# Altium schematic sheet Sheet1.SchDoc
size A3
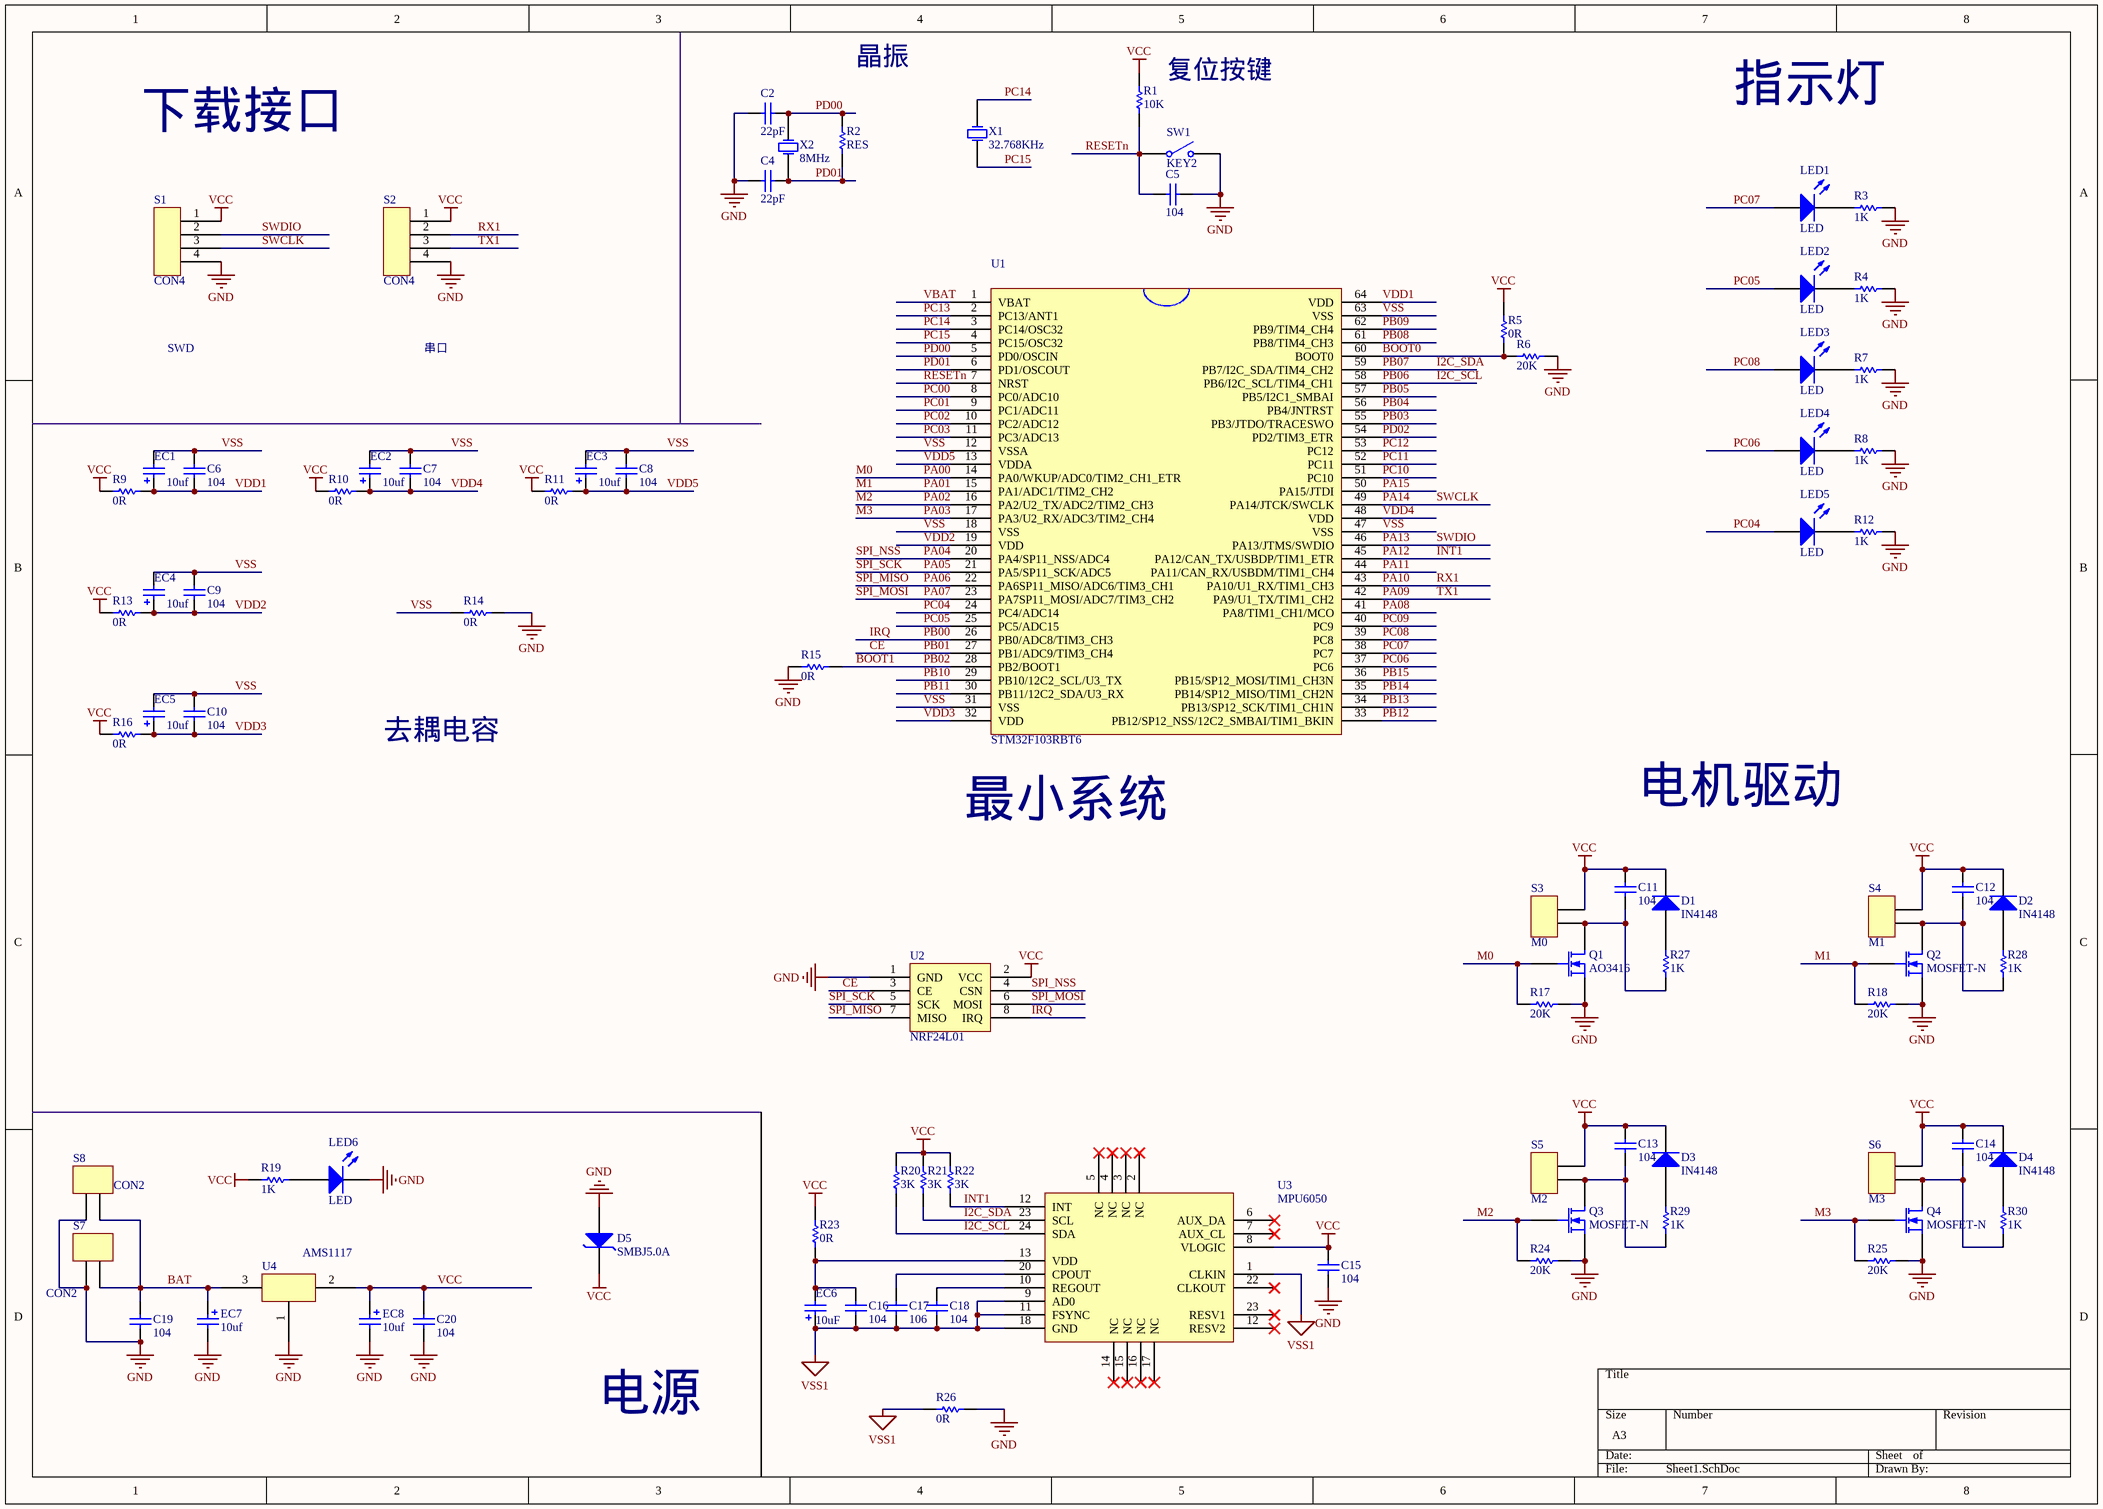
[diagram p0: Sheet1.SchDoc]

## Parts
C2  22pF  [0805]
C4  22pF  [0805]
C5  104  [0603]
C6  104  [0603]
C7  104  [0603]
C8  104  [0603]
C9  104  [0603]
C10  104  [0603]
C11  104  [0603]
C12  104  [0603]
C13  104  [0603]
C14  104  [0603]
C15  104  [0603]
C16  104  [0603]
C17  106  [0805]
C18  104  [0603]
C19  104  [0603]
C20  104  [0603]
D1  IN4148  [1206]
D2  IN4148  [1206]
D3  IN4148  [1206]
D4  IN4148  [1206]
D5  SMBJ5.0A  [DIOM4436X23N]
EC1  10uf  [1206]
EC2  10uf  [1206]
EC3  10uf  [1206]
EC4  10uf  [1206]
EC5  10uf  [1206]
EC6  10uF  [1206]
EC7  10uf  [1206]
EC8  10uf  [1206]
LED1  LED  [0805]
LED2  LED  [0805]
LED3  LED  [0805]
LED4  LED  [0805]
LED5  LED  [0805]
LED6  LED  [0805]
Q1  AO3416  [SOT-23_N]
Q2  MOSFET-N  [SOT-23_N]
Q3  MOSFET-N  [SOT-23_N]
Q4  MOSFET-N  [SOT-23_N]
R1  10K  [0603]
R2  RES  [0805]
R3  1K  [0603]
R4  1K  [0603]
R5  0R  [0603]
R6  20K  [0603]
R7  1K  [0603]
R8  1K  [0603]
R9  0R  [0603]
R10  0R  [0603]
R11  0R  [0603]
R12  1K  [0603]
R13  0R  [0603]
R14  0R  [0603]
R15  0R  [0603]
R16  0R  [0603]
R17  20K  [0603]
R18  20K  [0603]
R19  1K  [0603]
R20  3K  [0603]
R21  3K  [0603]
R22  3K  [0603]
R23  0R  [0603]
R24  20K  [0603]
R25  20K  [0603]
R26  0R  [0603]
R27  1K  [0603]
R28  1K  [0603]
R29  1K  [0603]
R30  1K  [0603]
S1  CON4  [SIP4]
S2  CON4  [SIP4]
S3  M0  [0805]
S4  M1  [0805]
S5  M2  [0805]
S6  M3  [0805]
S7  CON2  [1206]
S8  CON2  [SIP2]
SW1  KEY2  [SSOP2N]
U1  STM32F103RBT6  [TSQFP50P1200X1200X160-64N]
U2  NRF24L01  [CN8]
U3  MPU6050  [QFN50P400X400X95_HS-25N]
U4  AMS1117  [SOT223]
X1  32.768KHz  [XTAL-50-2]
X2  8MHz  [XTAL-200]

## Nets
GND: C2.1 C4.1 C5.2 C15.2 C19.2 C20.2 D5.1(A) EC7.2 EC8.2 LED6.2(K) Q1.3(S) Q2.3(S) Q3.3(S) Q4.3(S) R3.2 R4.2 R6.2 R7.2 R8.2 R12.2 R14.2 R15.1 R17.2 R18.2 R24.2 R25.2 R26.2 S1.4 S2.4 S7.2 S8.2 SW1.2(NO1) U2.1(GND) U4.1
VCC: C11.2 C12.2 C13.2 C14.2 C15.1 C20.1 D1.2(K) D2.2(K) D3.2(K) D4.2(K) D5.2(K) EC8.1 R1.2 R5.2 R9.1 R10.1 R11.1 R13.1 R16.1 R19.1 R20.2 R21.2 R22.2 R23.2 S1.1 S2.1 S3.1 S4.1 S5.1 S6.1 U2.2(VCC) U3.8(VLOGIC) U4.2
VSS1: C16.1 C17.2 C18.2 EC6.1 R26.1 U3.1(CLKIN) U3.9(AD0) U3.11(FSYNC) U3.18(GND)
BAT: C19.1 EC7.1 S7.1 S8.1 U4.3
BOOT0: R5.1 R6.1 U1.60(BOOT0)
BOOT1: R15.2 U1.28(PB2/BOOT1)  [also labelled PB02]
CE: U1.27(PB1/ADC9/TIM3_CH4) U2.3(CE)  [also labelled PB01]
I2C_SCL: R20.1 U1.58(PB6/I2C_SCL/TIM4_CH1) U3.24(SDA)  [also labelled PB06]
I2C_SDA: R21.1 U1.59(PB7/I2C_SDA/TIM4_CH2) U3.23(SCL)  [also labelled PB07]
INT1: R22.1 U1.45(PA12/CAN_TX/USBDP/TIM1_ETR) U3.12(INT)  [also labelled PA12]
IRQ: U1.26(PB0/ADC8/TIM3_CH3) U2.8(IRQ)  [also labelled PB00]
M0: Q1.2(G) R17.1 U1.14(PA0/WKUP/ADC0/TIM2_CH1_ETR)  [also labelled PA00]
M1: Q2.2(G) R18.1 U1.15(PA1/ADC1/TIM2_CH2)  [also labelled PA01]
M2: Q3.2(G) R24.1 U1.16(PA2/U2_TX/ADC2/TIM2_CH3)  [also labelled PA02]
M3: Q4.2(G) R25.1 U1.17(PA3/U2_RX/ADC3/TIM2_CH4)  [also labelled PA03]
PA04: U1.20(PA4/SP11_NSS/ADC4) U2.4(CSN)  [also labelled SPI_NSS]
PA05: U1.21(PA5/SP11_SCK/ADC5) U2.5(SCK)  [also labelled SPI_SCK]
PA06: U1.22(PA6SP11_MISO/ADC6/TIM3_CH1) U2.7(MISO)  [also labelled SPI_MISO]
PA07: U1.23(PA7SP11_MOSI/ADC7/TIM3_CH2) U2.6(MOSI)  [also labelled SPI_MOSI]
PA08: U1.41(PA8/TIM1_CH1/MCO)
PA09: S2.3 U1.42(PA9/U1_TX/TIM1_CH2)  [also labelled TX1]
PA10: S2.2 U1.43(PA10/U1_RX/TIM1_CH3)  [also labelled RX1]
PA11: U1.44(PA11/CAN_RX/USBDM/TIM1_CH4)
PA13: S1.2 U1.46(PA13/JTMS/SWDIO)  [also labelled SWDIO]
PA14: S1.3 U1.49(PA14/JTCK/SWCLK)  [also labelled SWCLK]
PA15: U1.50(PA15/JTDI)
PB03: U1.55(PB3/JTDO/TRACESWO)
PB04: U1.56(PB4/JNTRST)
PB05: U1.57(PB5/I2C1_SMBAI)
PB08: U1.61(PB8/TIM4_CH3)
PB09: U1.62(PB9/TIM4_CH4)
PB10: U1.29(PB10/12C2_SCL/U3_TX)
PB11: U1.30(PB11/12C2_SDA/U3_RX)
PB12: U1.33(PB12/SP12_NSS/12C2_SMBAI/TIM1_BKIN)
PB13: U1.34(PB13/SP12_SCK/TIM1_CH1N)
PB14: U1.35(PB14/SP12_MISO/TIM1_CH2N)
PB15: U1.36(PB15/SP12_MOSI/TIM1_CH3N)
PC00: U1.8(PC0/ADC10)
PC01: U1.9(PC1/ADC11)
PC02: U1.10(PC2/ADC12)
PC03: U1.11(PC3/ADC13)
PC04: LED5.1(A) U1.24(PC4/ADC14)
PC05: LED2.1(A) U1.25(PC5/ADC15)
PC06: LED4.1(A) U1.37(PC6)
PC07: LED1.1(A) U1.38(PC7)
PC08: LED3.1(A) U1.39(PC8)
PC09: U1.40(PC9)
PC10: U1.51(PC10)
PC11: U1.52(PC11)
PC12: U1.53(PC12)
PC13: U1.2(PC13/ANT1)
PC14: U1.3(PC14/OSC32) X1.2(OSC2)
PC15: U1.4(PC15/OSC32) X1.1(OSC1)
PD00: C2.2 R2.2 U1.5(PD0/OSCIN) X2.2(OSC2)
PD01: C4.2 R2.1 U1.6(PD1/OSCOUT) X2.1(OSC1)
PD02: U1.54(PD2/TIM3_ETR)
RESETn: C5.1 R1.1 SW1.1(COMMON1) U1.7(NRST)
VBAT: U1.1(VBAT)
VDD1: C6.1 EC1.1 R9.2 U1.64(VDD)
VDD2: C9.1 EC4.1 R13.2 U1.19(VDD)
VDD3: C10.1 EC5.1 R16.2 U1.32(VDD)
VDD4: C7.1 EC2.1 R10.2 U1.48(VDD)
VDD5: C8.1 EC3.1 R11.2 U1.13(VDDA)
VSS: C6.2 C7.2 C8.2 C9.2 C10.2 EC1.2 EC2.2 EC3.2 EC4.2 EC5.2 R14.1 U1.12(VSSA) U1.18(VSS) U1.31(VSS) U1.47(VSS) U1.63(VSS)
NetC11_1: C11.1 Q1.1(D) R27.1 S3.2
NetC12_1: C12.1 Q2.1(D) R28.1 S4.2
NetC13_1: C13.1 Q3.1(D) R29.1 S5.2
NetC14_1: C14.1 Q4.1(D) R30.1 S6.2
NetC16_2: C16.2 EC6.2 R23.1 U3.13(VDD)
NetC17_1: C17.1 U3.20(CPOUT)
NetC18_1: C18.1 U3.10(REGOUT)
NetD1_1: D1.1(A) R27.2
NetD2_1: D2.1(A) R28.2
NetD3_1: D3.1(A) R29.2
NetD4_1: D4.1(A) R30.2
NetLED1_2: LED1.2(K) R3.1
NetLED2_2: LED2.2(K) R4.1
NetLED3_2: LED3.2(K) R7.1
NetLED4_2: LED4.2(K) R8.1
NetLED5_2: LED5.2(K) R12.1
NetLED6_1: LED6.1(A) R19.2

Not connected (* = marked no-connect by the designer): U3 2(NC)* 3(NC)* 4(NC)* 5(NC)* 6(AUX_DA)* 7(AUX_CL)* 14(NC)* 15(NC)* 16(NC)* 17(NC)* 22(CLKOUT)*; U4 4

## Notes on the sheet
- 晶振
- (near R1) 复位按键
- 指示灯
- 下载接口
- SWD
- 串口
- 去耦电容
- (near U1) 最小系统
- 电机驱动
- 电源

## Library data of the parts
C2 C4-C20 = CAP
D1-D4 = DIODE
EC1-EC8 = EC
Q1-Q4 = MOSFET-N: N-Channel MOSFET; Published: 8-Jun-2000; LatestRevisionDate: 17-Jul-2002; LatestRevisionNote: Re-released for DXP Platform.; PackageVersion: 1995/1996; PackageReference: E3; Publisher: Altium Limited; PackageDescription: TO, Flat Index; 3 In-Line, Axial Leads; Body Dia. 4.6mm; Lead Dia. 0.5 mm (max)
R1 R3-R30 = RES
S3-S6 = CON2
X1 X2 = XTAL